# Altium schematic sheet rf_lpf_60_40.SchDoc: mcHF Pro Transceiver RF board
size A3; Author: Krassi Atanassov; CompanyName: MØNKA; Engineer: For radio amateurs experimentation, non-commercial use only. Thank you!; Revision: 0.8.2; SheetTotal: 14
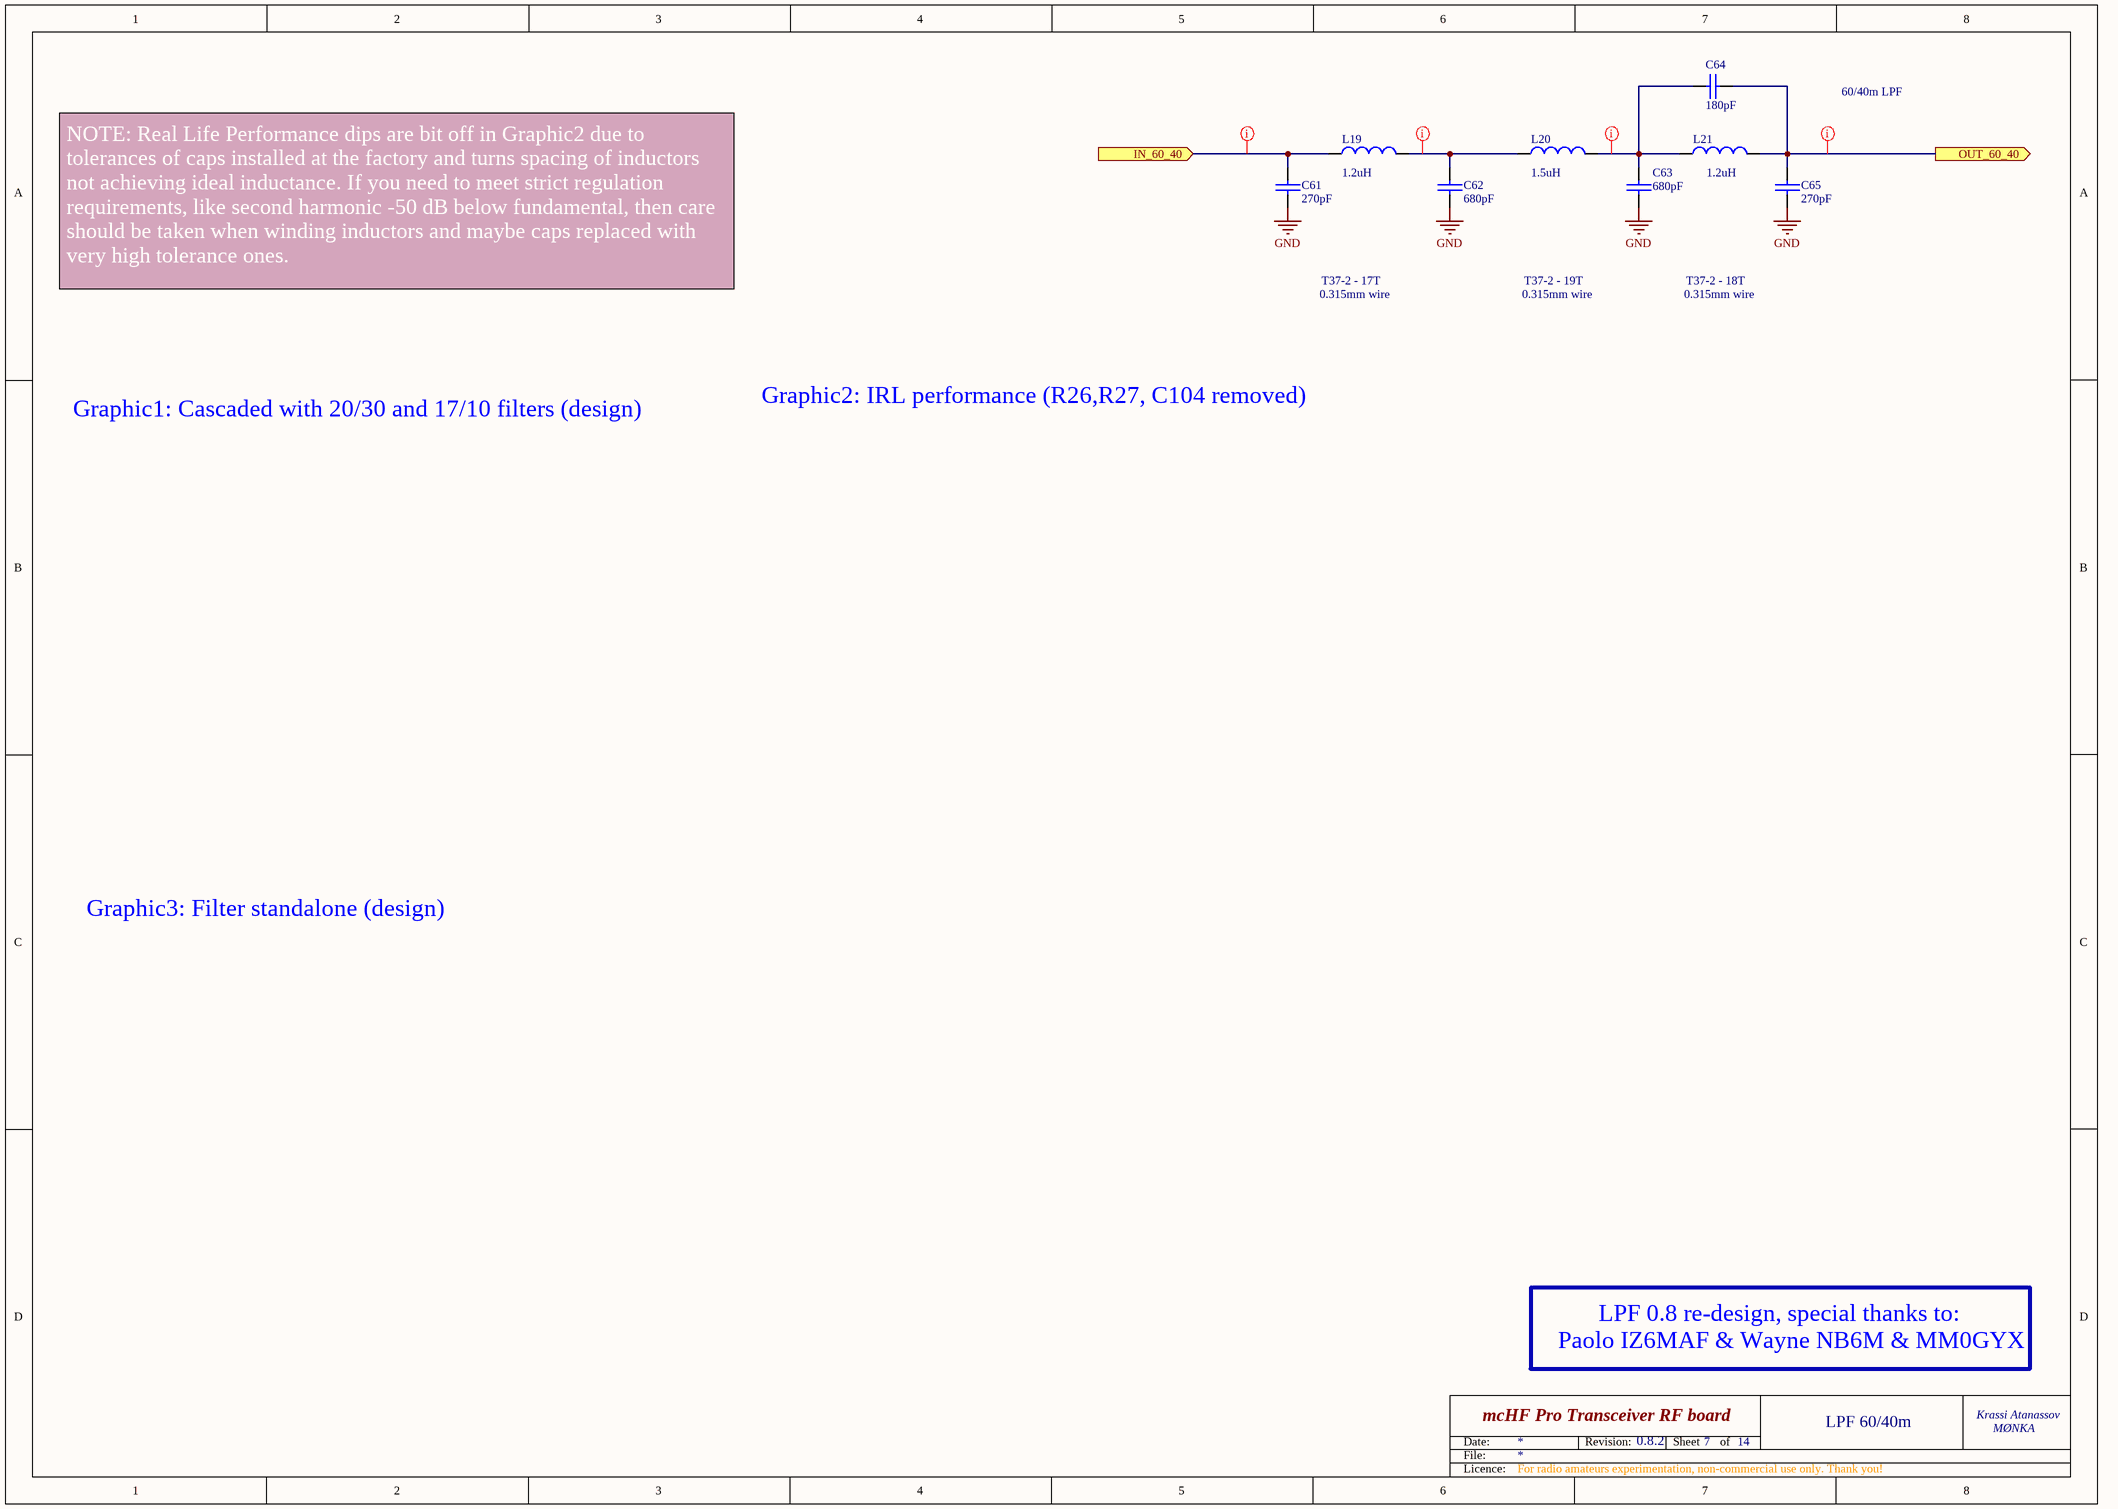
[diagram p0: rf_lpf_60_40.SchDoc]

## Parts
C61  270pF  [0805]
C62  680pF  [0805]
C63  680pF  [0805]
C64  180pF  [0805]
C65  270pF  [0805]
L19  Inductance: 1.2uH  [LPF_IND]  (hidden comment: T37-2)
L20  Inductance: 1.5uH  [LPF_IND]  (hidden comment: T37-2)
L21  Inductance: 1.2uH  [LPF_IND]  (hidden comment: T37-2)

## Ports
IN_60_40 (in), OUT_60_40 (out)

## Nets
GND: C61.1 C62.1 C63.1 C65.1
IN_60_40: C61.2 L19.1 ; port IN_60_40
OUT_60_40: C64.1 C65.2 L21.2 ; port OUT_60_40
NetC62_2: C62.2 L19.2 L20.1
NetC63_2: C63.2 C64.2 L20.2 L21.1

## Layout directives
rule Width Constraint [Pref Width = 30mil    Min Width = 30mil    Max Width = 30mil]: IN_60_40, NetC62_2, NetC63_2, OUT_60_40

## Notes on the sheet
- 60/40m LPF
- NOTE: Real Life Performance dips are bit off in Graphic2 due to tolerances of caps installed at the factory and turns spacing of inductors not achieving ideal inductance. If you need to meet strict regulation requirements, like second harmonic -50 dB below fundamental, then care should be taken when winding inductors and maybe caps replaced with very high tolerance ones.
- T37-2 - 17T
- 0.315mm wire
- T37-2 - 19T
- T37-2 - 18T
- Graphic1: Cascaded with 20/30 and 17/10 filters (design)
- Graphic2: IRL performance (R26,R27, C104 removed)
- Graphic3: Filter standalone (design)
- LPF 0.8 re-design, special thanks to:
- Paolo IZ6MAF & Wayne NB6M & MM0GYX
- 7
- LPF 60/40m
- Date:
- File:
- Revision:
- Sheet
- of
- Licence:

## Library data of the parts
C61-C65 = CAP: Capacitor; Notes: COG/NPO; Voltage: 100V
L19-L21 = LPF_IND: T37-2 handwound inductor; Notes: post assembly; Price: 0.20